# EAGLE design Adafruit HT16K33 breakout (EAGLE 6.3)
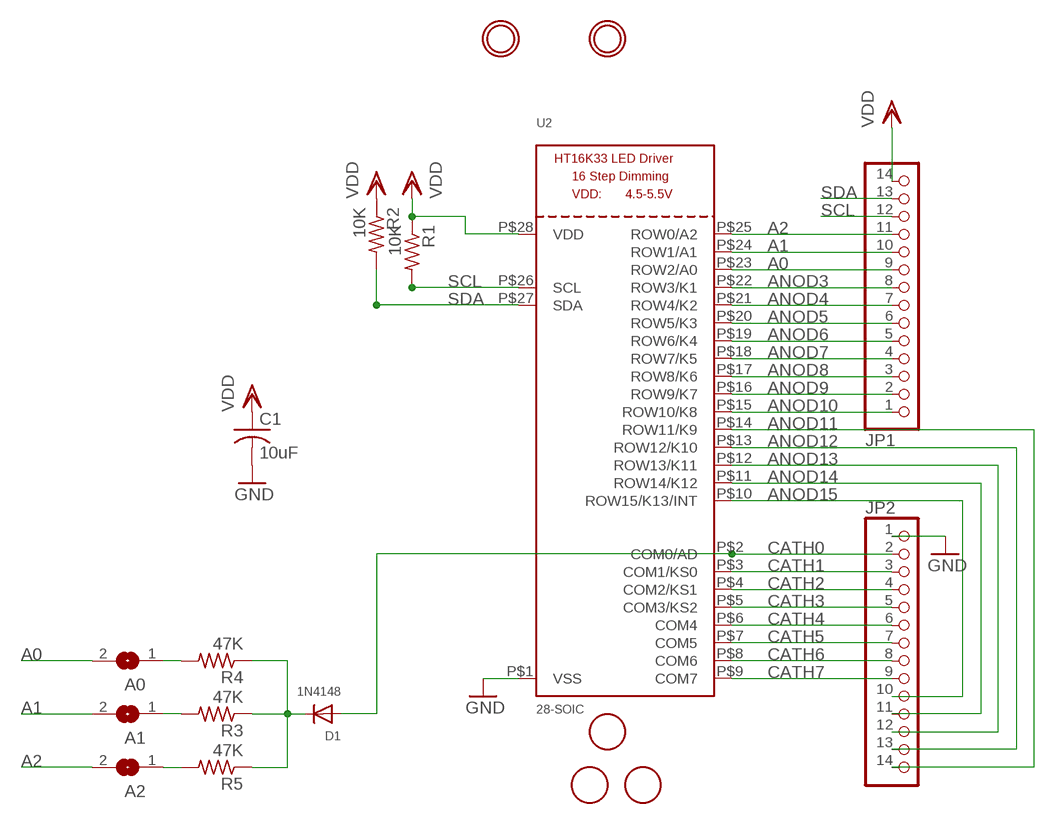
[diagram p0: schematic, sheet 1]

## Parts
A0  SOLDERJUMPERREFLOW_NOPASTE  [SOLDERJUMPER_REFLOW_NOPASTE]
A1  SOLDERJUMPERREFLOW_NOPASTE  [SOLDERJUMPER_REFLOW_NOPASTE]
A2  SOLDERJUMPERREFLOW_NOPASTE  [SOLDERJUMPER_REFLOW_NOPASTE]
C1  10uF  C-USC0805  [C0805]
D1  1N4148  DIODESOD-323F  [SOD-323F]
JP1  PINHD-1X14-CB  [1X14-CB]
JP2  PINHD-1X14-CB  [1X14-CB]
R1  10K  R-US_R0805  [R0805]
R2  10K  R-US_R0805  [R0805]
R3  47K  R-US_R0805  [R0805]
R4  47K  R-US_R0805  [R0805]
R5  47K  R-US_R0805  [R0805]
U2  28-SOIC  HT16K33_SOP28  [SOP28_300MIL]
U$1  FIDUCIAL  [FIDUCIAL_1MM]
U$2  FIDUCIAL  [FIDUCIAL_1MM]
U$4  MOUNTINGHOLE2.5  [MOUNTINGHOLE_2.5_PLATED]
U$5  MOUNTINGHOLE2.5  [MOUNTINGHOLE_2.5_PLATED]
U$6  FIDUCIAL  [FIDUCIAL_1MM]

## Nets
A0: A0.2 JP1.9 U2.P$23(ROW2/A0)
A1: A1.2 JP1.10 U2.P$24(ROW1/A1)
A2: A2.2 JP1.11 U2.P$25(ROW0/A2)
ANOD3: JP1.8 U2.P$22(ROW3/K1)
ANOD4: JP1.7 U2.P$21(ROW4/K2)
ANOD5: JP1.6 U2.P$20(ROW5/K3)
ANOD6: JP1.5 U2.P$19(ROW6/K4)
ANOD7: JP1.4 U2.P$18(ROW7/K5)
ANOD8: JP1.3 U2.P$17(ROW8/K6)
ANOD9: JP1.2 U2.P$16(ROW9/K7)
ANOD10: JP1.1 U2.P$15(ROW10/K8)
ANOD11: JP2.14 U2.P$14(ROW11/K9)
ANOD12: JP2.13 U2.P$13(ROW12/K10)
ANOD13: JP2.12 U2.P$12(ROW13/K11)
ANOD14: JP2.11 U2.P$11(ROW14/K12)
ANOD15: JP2.10 U2.P$10(ROW15/K13/INT)
CATH0: D1.A JP2.2 U2.P$2(COM0/AD)
CATH1: JP2.3 U2.P$3(COM1/KS0)
CATH2: JP2.4 U2.P$4(COM2/KS1)
CATH3: JP2.5 U2.P$5(COM3/KS2)
CATH4: JP2.6 U2.P$6(COM4)
CATH5: JP2.7 U2.P$7(COM5)
CATH6: JP2.8 U2.P$8(COM6)
CATH7: JP2.9 U2.P$9(COM7)
GND: C1.2 JP2.1 U2.P$1(VSS)
N$9: A2.1 R5.2
N$16: D1.C R3.1 R4.1 R5.1
N$19: A1.1 R3.2
N$20: A0.1 R4.2
SCL: JP1.12 R1.2 U2.P$26(SCL)
SDA: JP1.13 R2.2 U2.P$27(SDA)
VDD: C1.1 JP1.14 R1.1 R2.1 U2.P$28(VDD)

## Library data of the parts
A0 A1 A2 = microbuilder:SOLDERJUMPER: SMD Solder JUMPER Solder the two pads together to create a connection, or remove the solder to break it. REFLOW - Use this footprint for solder paste and reflow ovens. WAVE - Use this footprint for hand-soldering (larger pads). CLOSED - Has a trace between the two pads to ensure it is closed by default. The trace needs to be cut to disable the jumper, and can be closed again by creating a solder bridge between the two pads.
C1 = rcl:C-US: CAPACITOR, American symbol
D1 = adafruit:DIODE: Diode SMADIODE - SMA Surface Mount Package 20V 1A Schottky Diode Digikey: 641-1014-6-ND DO-1N4148 - Through Hole Small Current Diode SOD-123 20V 1 A (.5mV Vf) Schottky Diode - Digikey: MBRX120TPMSCT-ND SOD-323 10V 570mA (.38mV Vf, 3ns) Schottky Diode - Digikey: ZLLS410CT-ND SOD-523 30V 30mA Schottky Diode (RB751S-40TE61) - Digikey: RB751S-40TE61CT-ND SOT23-R/W - SOT23 Package (R = Solder Paste/Reflow Ovens, W = Hand-Soldering) BAT54Film 40V 300mA - Digikey: 497-7162-1-ND
JP1 JP2 = adafruit:PINHD-1X14: PIN HEADER
R1-R5 = rcl:R-US_: RESISTOR, American symbol
U2 = microbuilder:HT16K33_SOP28
U$1 U$2 U$6 = adafruit:FIDUCIAL: For use by pick and place machines to calibrate the vision/machine, 1mm By microbuilder.eu
U$4 U$5 = microbuilder:MOUNTINGHOLE: Mounting Hole For #2 screws (0.086"/2.18mm width, 0.094"/2.4mm hole) use 2.5mm

## Board
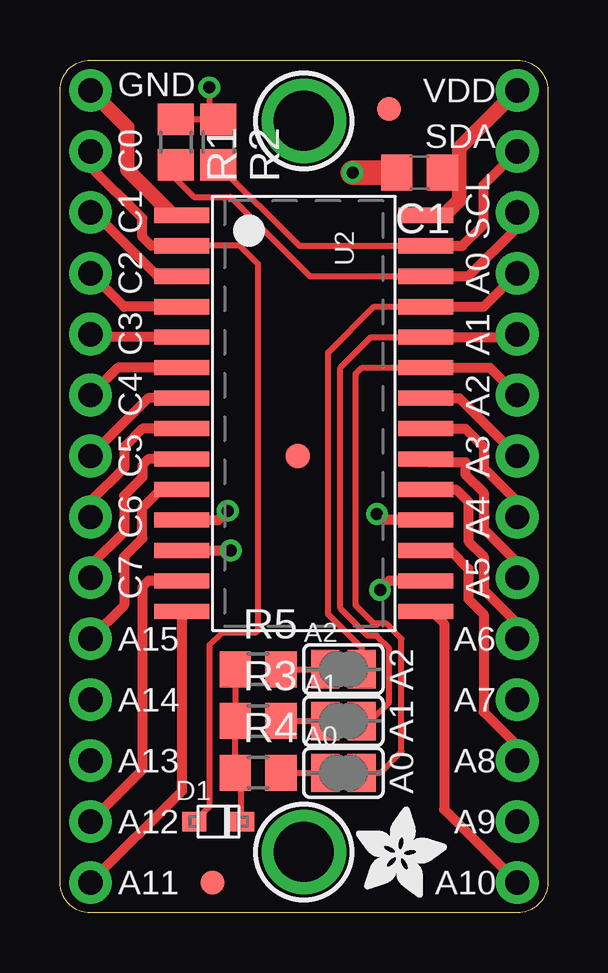
[diagram p1: board, top side]
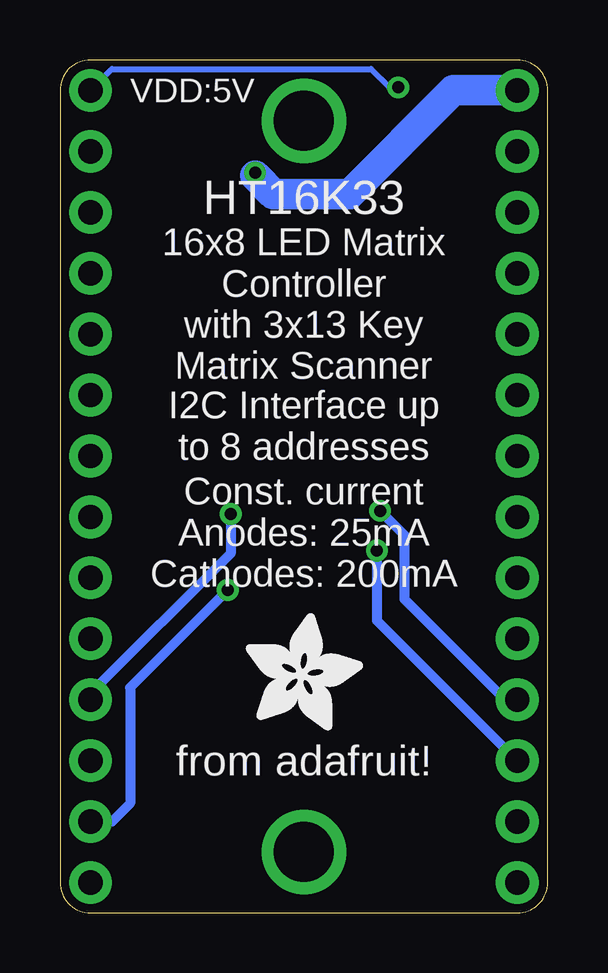
[diagram p2: board, bottom side, seen from below]

Size 20.32 x 35.56 mm. Coordinates in mm from the lower left corner, seen from the top.
Outline: 1.27,35.56 19.05,35.56 arc-90 20.32,34.29 20.32,1.27 arc-90 19.05,0 1.27,0 arc-90 0,1.27 0,34.29 arc-90 1.27,35.56
Copper layers (1*16): Top 0.035mm / dielectric 1.5mm / Bottom 0.035mm
Design rules "adafruit *": minimum track width 8mil, minimum drill 15.5mil, track to track 8mil, track to pad 8mil, pad to pad 8mil, via to via 8mil, smd to smd 8mil, copper to edge 10mil, drill to drill 8mil, minimum pad ring 10mil, minimum via ring 8mil, stop-mask expansion 4mil, vias tented up to drill 20mil, thermal gap 10mil

### Footprints (pad centres in the part's own frame; a part is rotated, then mirrored left to right if it is on the bottom)
SOLDERJUMPER_REFLOW_NOPASTE = smd 1.168 x 1.6: 1 -0.762,0; 2 0.762,0
C0805 = smd 1.3 x 1.5: 1 -0.95,0; 2 0.95,0
SOD-323F = smd 1 x 0.8: A -1,0; C 1,0
1X14-CB = drill 1.016 pad 1.778: 1 -16.51,0; 2 -13.97,0; 3 -11.43,0; 4 -8.89,0; 5 -6.35,0; 6 -3.81,0; 7 -1.27,0; 8 1.27,0; 9 3.81,0; 10 6.35,0; 11 8.89,0; 12 11.43,0; 13 13.97,0; 14 16.51,0
R0805 = smd 1.3 x 1.5: 1 -0.95,0; 2 0.95,0
SOP28_300MIL = smd 0.635 x 2.286: P$1 -8.255,-5.08; P$2 -6.985,-5.08; P$3 -5.715,-5.08; P$4 -4.445,-5.08; P$5 -3.175,-5.08; P$6 -1.905,-5.08; P$7 -0.635,-5.08; P$8 0.635,-5.08; P$9 1.905,-5.08; P$10 3.175,-5.08; P$11 4.445,-5.08; P$12 5.715,-5.08; P$13 6.985,-5.08; P$14 8.255,-5.08; P$15 8.255,5.08; P$16 6.985,5.08; P$17 5.715,5.08; P$18 4.445,5.08; P$19 3.175,5.08; P$20 1.905,5.08; P$21 0.635,5.08; P$22 -0.635,5.08; P$23 -1.905,5.08; P$24 -3.175,5.08; P$25 -4.445,5.08; P$26 -5.715,5.08; P$27 -6.985,5.08; P$28 -8.255,5.08
FIDUCIAL_1MM = smd 1 x 1: 1 0,0
MOUNTINGHOLE_2.5_PLATED = drill 2.5 pad 3.2: P$1 0,0

### Placement (x,y rotation side)
A0  11.81,5.84 0 top
A1  11.81,8 0 top
A2  11.81,10.16 0 top
C1  14.99,30.86 180 top
D1  6.6,3.81 0 top
JP1  19.05,17.78 90 top
JP2  1.27,17.78 270 top
R1  4.83,32.13 270 top
R2  6.6,32.13 270 top
R3  8.26,8 0 top
R4  8.26,5.84 0 top
R5  8.26,10.16 0 top
U2  10.16,20.83 270 top
U$1  13.72,33.53 90 top
U$2  9.91,19.05 90 top
U$3  [ADAFRUIT_3.5MM]  12.32,0.64 0 top
U$4  10.16,33.02 0 top
U$5  10.16,2.54 0 top
U$6  6.35,1.27 0 top
U$7  [ADAFRUIT_5MM]  12.57,7.62 0 bottom

### Tracks (layer width: path | path; a pad name or v marks a point on that pad's centre or on a via)
A0
  Top 0.254: A0.2 13.34,5.84 14.22,6.73 14.22,11.43 13.59,12.07 13.08,12.07 12.32,12.83 12.32,22.48 12.57,22.73 U2.P$23
  Top 0.406: U2.P$23 17.91,22.73 JP1.9
A1
  Top 0.254: A1.2 12.95,8 13.72,8.76 13.72,11.05 13.21,11.56 12.83,11.56 11.68,12.7 11.68,22.73 12.95,24 U2.P$24
  Top 0.406: U2.P$24 18.92,24 JP1.10
A2
  Top 0.254: A2.2 12.57,11.05 11.18,12.45 11.18,23.37 13.08,25.27 U2.P$25
  Top 0.406: U2.P$25 17.65,25.27 JP1.11
ANOD3
  Top 0.406: U2.P$22 16.64,21.46 JP1.8
ANOD4
  Top 0.406: U2.P$21 16.89,20.19 17.65,19.43 17.65,18.54 19.05,17.14 JP1.7
ANOD5
  Top 0.406: U2.P$20 15.37,18.8 16.89,18.8 16.89,18.29 17.65,17.53 17.65,16 19.05,14.61 JP1.6
ANOD6
  Top 0.406: U2.P$19 16.51,17.65 17.02,17.14 17.02,15.49 17.65,14.86 17.65,13.46 19.05,12.07 JP1.5
ANOD7  (via drill 0.5)
  Top 0.406: U2.P$18 13.46,16.38 v13.21,16.64
  Bottom 0.406: v13.21,16.64 13.21,14.99 19.05,9.14 JP1.4
ANOD8
  Top 0.406: U2.P$17 16.26,15.11 17.02,14.35 17.02,13.08 17.65,12.45 17.65,8.38 19.05,6.99 JP1.3
ANOD9  (via drill 0.5)
  Top 0.406: U2.P$16 13.72,13.84 v13.34,13.46
  Bottom 0.406: v13.34,13.46 17.4,9.4 17.4,4.57 18.16,3.81 JP1.2
ANOD10
  Top 0.406: U2.P$15 15.49,12.57 16,12.07 16,4.32 JP1.1
ANOD11
  Top 0.406: U2.P$14 5.08,5.08 JP2.14
ANOD12
  Top 0.406: U2.P$13 3.68,13.84 3.43,13.59 3.43,5.97 JP2.13
ANOD13  (via drill 0.5)
  Top 0.406: U2.P$12 v7.11,15.11
  Bottom 0.406: v7.11,15.11 7.11,12.19 JP2.12
ANOD14  (via drill 0.5)
  Top 0.406: U2.P$11 6.6,16.38 v6.99,16.76
  Bottom 0.406: v6.99,16.76 5.97,15.75 5.97,13.08 1.78,8.89 JP2.11
ANOD15
  Top 0.406: 5.46,17.65 U2.P$10 4.19,17.65 3.43,16.89 3.43,15.62 2.67,14.86 2.67,12.83 JP2.10
CATH0
  Top 0.254: U2.P$2 7.49,27.81 8.26,27.05 8.26,11.8 8.14,11.68 6.73,11.68 6.22,11.18 6.22,4.43 D1.A
  Top 0.406: U2.P$2 3.81,27.81 3.43,28.19 3.43,28.96 1.27,31.12 JP2.2
CATH1
  Top 0.406: U2.P$3 4.06,26.54 1.4,29.21 JP2.3
CATH2
  Top 0.406: U2.P$4 2.67,25.27 JP2.4
CATH3
  Top 0.406: U2.P$5 1.4,24 JP2.5
CATH4
  Top 0.406: U2.P$6 2.41,22.73 JP2.6
CATH5
  Top 0.406: U2.P$7 3.68,21.46 JP2.7
CATH6
  Top 0.406: U2.P$8 3.43,20.19 2.67,19.43 2.67,18.54 1.27,17.14 JP2.8
CATH7
  Top 0.406: U2.P$9 3.68,18.92 3.43,18.67 3.43,18.16 2.67,17.4 2.67,15.88 1.27,14.48 JP2.9
GND  (via drill 0.5)
  Top 0.61: U2.P$1 4.7,29.08 2.79,30.99 2.79,32.77 JP2.1
  Top 1.016: C1.2 v12.19,30.86
  Bottom 0.61: v12.19,30.86 12.19,30.73
  Bottom 1.27: 12.19,30.73 11.43,29.97 8.26,29.97 3.94,34.29 JP2.1
N$9
  Top 0.254: R5.2 A2.1
N$16
  Top 0.254: D1.C 7.56,3.86 7.56,5.65 7.37,5.84 R4.1 R3.1 R5.1
N$19
  Top 0.254: R3.2 A1.1
N$20
  Top 0.254: R4.2 A0.1
SCL
  Top 0.254: U2.P$26 10.41,26.54 7.11,29.84 5.59,29.84 4.83,30.61 R1.2
  Top 0.406: U2.P$26 17.02,26.54 19.05,28.58 JP1.12
SDA
  Top 0.254: U2.P$27 9.97,27.81 R2.2
  Top 0.406: U2.P$27 16.76,27.81 17.65,28.7 17.65,30.35 JP1.13
VDD  (via drill 0.5)
  Top 0.254: R1.1 6.22,33.08 | 6.22,33.08 R2.1 | v6.22,34.42 6.22,33.08
  Top 0.61: U2.P$28 16,29.08 16.64,29.72 16.64,30.86 | 16.64,30.86 16.64,31.88 JP1.14 | C1.1 16.64,30.86
  Bottom 0.254: JP1.14 18.16,35.18 7.37,35.18 6.6,34.42 v6.22,34.42

### Text on the board
tPlace: VDD | GND | SDA | C0 | C1 | SCL | C2 | A0 | C3 | A1 | C4 | A2 | C5 | A3 | C6 | A4 | C7 | A5 | A6 | A15 | A2 | A7 | A14 | A1 | A8 | A13 | A0 | A9 | A12 | A10 | A11
bPlace: VDD:5V | HT16K33 | 16x8 LED Matrix / Controller / with 3x13 Key / Matrix Scanner | I2C Interface up / to 8 addresses | Const. current / Anodes: 25mA / Cathodes: 200mA | from adafruit!